# Altium project DAC-AK4493-DUAL.PrjPcb
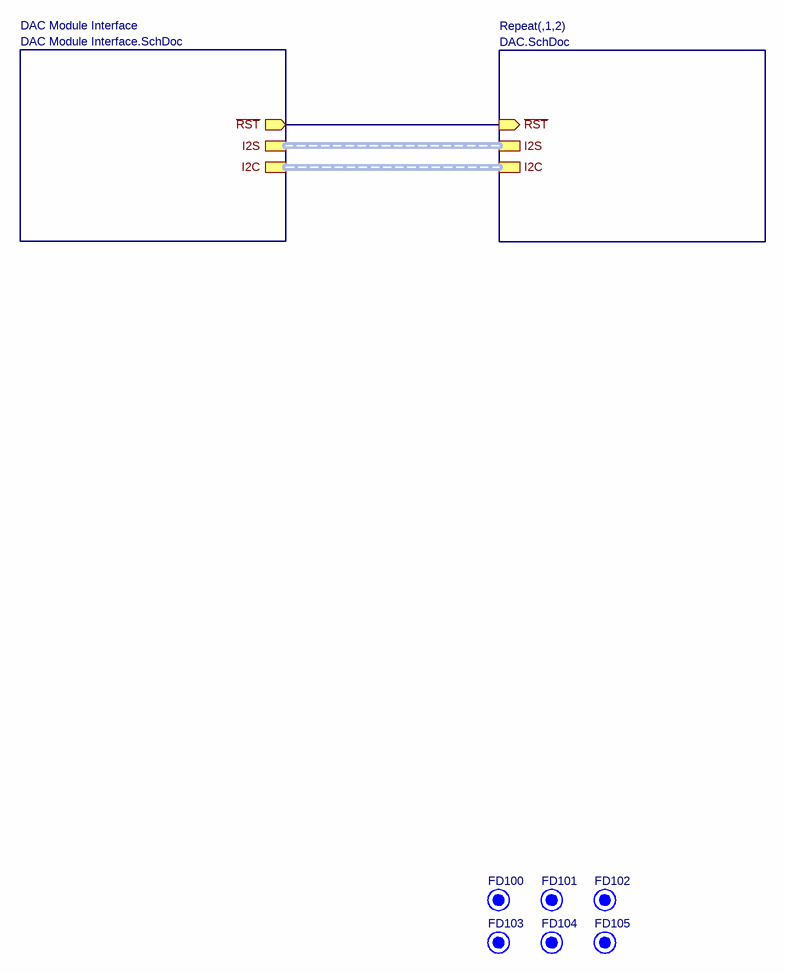
[diagram p0: Hardware Achitecture.SchDoc]
ProjectAuthors: Klossner, Lüthi; ProjectName: DAC-AK4493-DUAL; Revision: 1.1
3 sheets, 94 parts. Net scope: hierarchical (ports join the sheet entries above them; power ports are global).
Board file: DAC-AK4493-DUAL.PcbDoc
Sheets:
  Hardware Achitecture.SchDoc
    1 = DAC.SchDoc
    2 = DAC.SchDoc
    DAC Module Interface = DAC Module Interface.SchDoc

## Sheet Hardware Achitecture.SchDoc
size A3; Date: 27.05.2014; DrawnBy: luths8; Organization: BFH; Address1: Bern University of Applied Sciences; Address2: Engineering and Information Technology; Address3: Jlcoweg 1; Address4: CH-3400 Burgdorf; DocumentNumber: 1; Revision: 1.1; SheetNumber: 1; SheetTotal: 3; CurrentDate: 27.05.2014

### Parts
FD100  Fiducial  [FIDUCIAL]  (value not drawn)  (no BOM)
FD101  Fiducial  [FIDUCIAL]  (value not drawn)  (no BOM)
FD102  Fiducial  [FIDUCIAL]  (value not drawn)  (no BOM)
FD103  Fiducial  [FIDUCIAL]  (value not drawn)  (no BOM)
FD104  Fiducial  [FIDUCIAL]  (value not drawn)  (no BOM)
FD105  Fiducial  [FIDUCIAL]  (value not drawn)  (no BOM)

### Sub-sheets
DAC Module Interface = DAC Module Interface.SchDoc: ~{RST} (out), I2S (harness I2S), I2C (harness I2C)
Repeat(,1,2) = DAC.SchDoc: ~{RST} (in), I2S (harness I2S), I2C (harness I2C)

### Nets
~{DAC_RST}: sheet Repeat(,1,2)/~{RST}, sheet DAC Module Interface/~{RST}

### Buses and harness runs
harness sheet DAC Module Interface/I2C = sheet Repeat(,1,2)/I2C
harness sheet DAC Module Interface/I2S = sheet Repeat(,1,2)/I2S

### Notes on the sheet
- Project:
- Size:
- Sheet:
- Title:
- A3
- of
- Drawn by:
- Revision:
- Date:
- Variant:
- b
- File:

### Library data of the parts
FD100-FD105 = Fiducial: Fiducial Marker

## Sheet DAC.SchDoc
size A3; Date: 27.05.2014; DrawnBy: luths8; Organization: BFH; Address1: Bern University of Applied Sciences; Address2: Engineering and Information Technology; Address3: Jlcoweg 1; Address4: CH-3400 Burgdorf; DocumentNumber: 10; Revision: 1.1; SheetNumber: 3; SheetTotal: 3; CurrentDate: 27.05.2014
Used 2 times, as channels 1, 2. Parts and nets are listed once, with the designators drawn on the sheet.
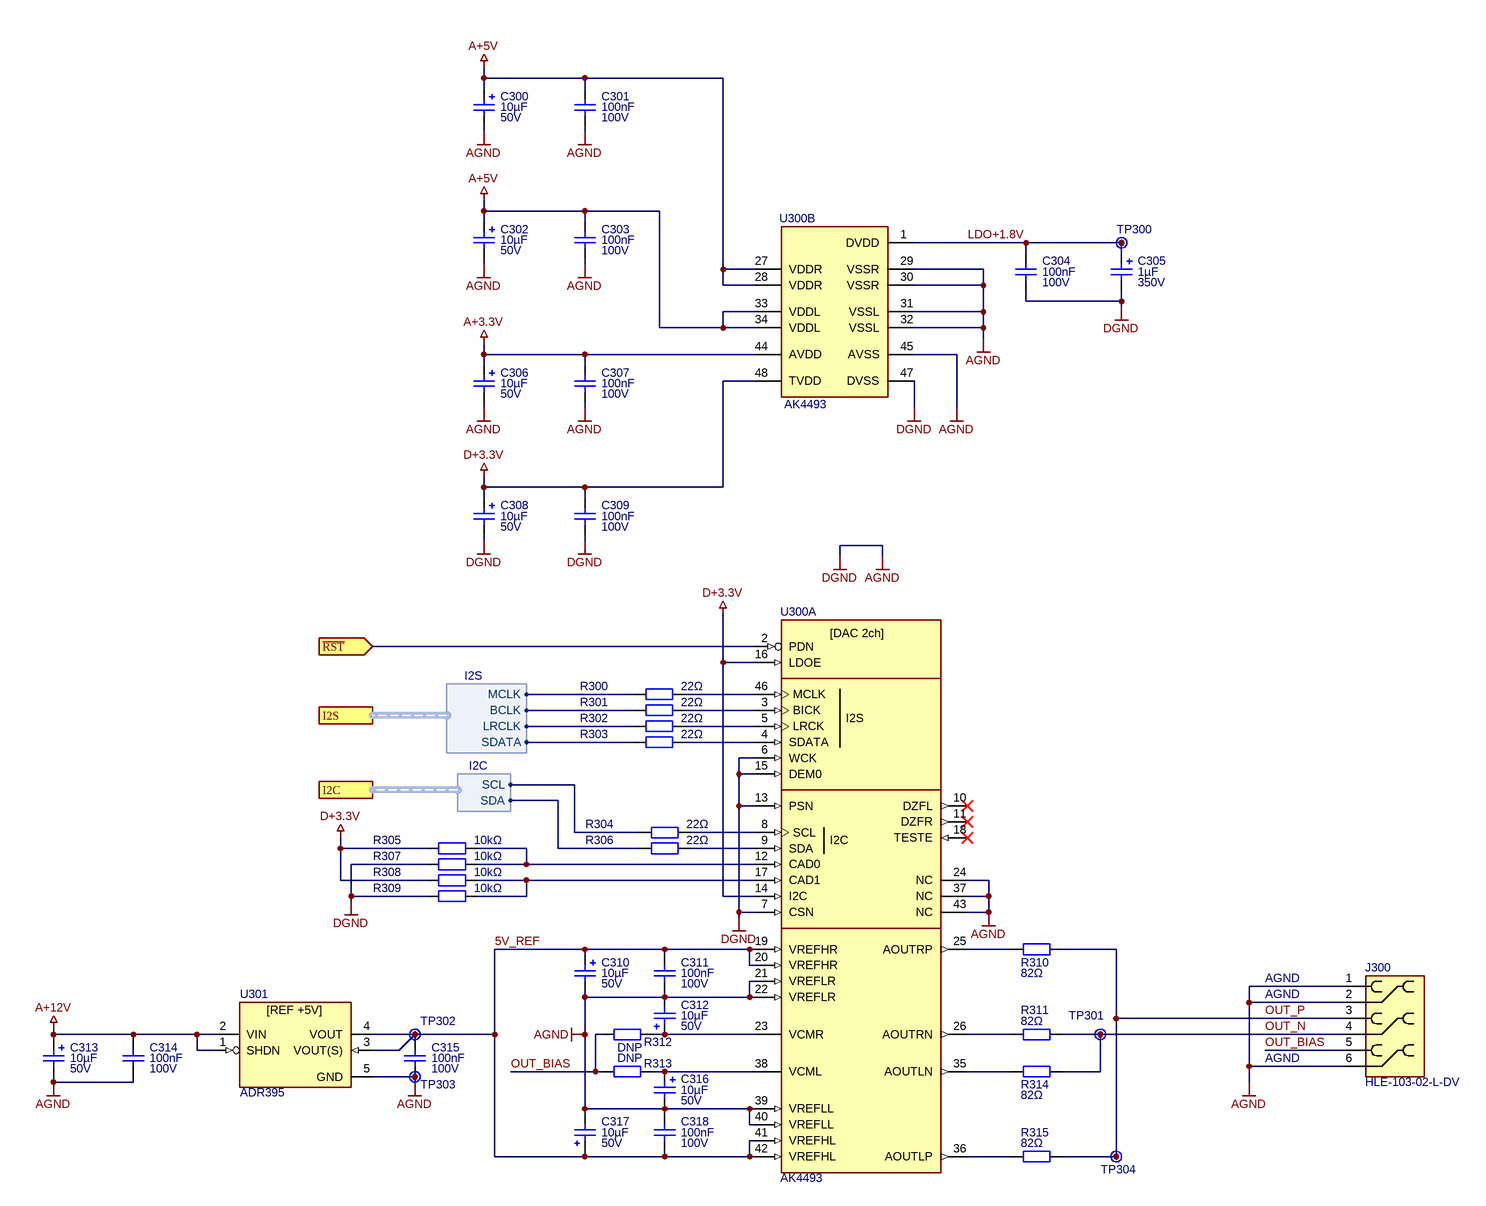
[diagram p1: DAC.SchDoc]

### Parts
C300  10µF  Voltage: 50V  [CAP-5-11.5-2]
C301  100nF  Voltage: 100V  [CAP_WIMA_MKP4F]
C302  10µF  Voltage: 50V  [CAP-5-11.5-2]
C303  100nF  Voltage: 100V  [CAP_WIMA_MKP4F]
C304  100nF  Voltage: 100V  [CAP_WIMA_MKP4F]
C305  1µF  Voltage: 350V  [CAP-6.3-11.2-2.5]
C306  10µF  Voltage: 50V  [CAP-5-11.5-2]
C307  100nF  Voltage: 100V  [CAP_WIMA_MKP4F]
C308  10µF  Voltage: 50V  [CAP-5-11.5-2]
C309  100nF  Voltage: 100V  [CAP_WIMA_MKP4F]
C310  10µF  Voltage: 50V  [CAP-5-11.5-2]
C311  100nF  Voltage: 100V  [CAP_WIMA_MKP4F]
C312  10µF  Voltage: 50V  [CAP-5-11.5-2]
C313  10µF  Voltage: 50V  [CAP-5-11.5-2]
C314  100nF  Voltage: 100V  [CAP_WIMA_MKP4F]
C315  100nF  Voltage: 100V  [CAP_WIMA_MKP4F]
C316  10µF  Voltage: 50V  [CAP-5-11.5-2]
C317  10µF  Voltage: 50V  [CAP-5-11.5-2]
C318  100nF  Voltage: 100V  [CAP_WIMA_MKP4F]
J300  HLE-103-02-L-DV  [HLE-103-02-XXX-DV]
R300  22Ω  [SMD0603RES]
R301  22Ω  [SMD0603RES]
R302  22Ω  [SMD0603RES]
R303  22Ω  [SMD0603RES]
R304  22Ω  [SMD0603RES]
R305  10kΩ  [SMD0603RES]
R306  22Ω  [SMD0603RES]
R307  10kΩ  [SMD0603RES]
R308  10kΩ  [SMD0603RES]
R309  10kΩ  [SMD0603RES]
R310  82Ω  [SMD0603RES]
R311  82Ω  [SMD0603RES]
R312  DNP  [SMD0603RES]
R313  DNP  [SMD0603RES]
R314  82Ω  [SMD0603RES]
R315  82Ω  [SMD0603RES]
TP300  Testpoint  [TP]  (value not drawn)  (no BOM)
TP301  Testpoint  [TP]  (value not drawn)  (no BOM)
TP302  Testpoint  [TP]  (value not drawn)  (no BOM)
TP303  Testpoint  [TP]  (value not drawn)  (no BOM)
TP304  Testpoint  [TP]  (value not drawn)  (no BOM)
U300  AK4493  [LQFP48]  (parts A,B of 2)
U301  ADR395  [SOT-23-5]

### Ports
I2C (harness I2C), I2S (harness I2S), ~{RST} (in)

### Harnesses
I2S: MCLK, BCLK, LRCLK, SDATA
I2C: SCL, SDA

### Nets
A+3.3V: C306.P C307.2(q) U300.44(AVDD)
A+5V: C300.P C301.2(q) C302.P C303.2(q) U300.27(VDDR) U300.28(VDDR) U300.33(VDDL) U300.34(VDDL)
A+12V: C313.P C314.2(q) U301.1(SHDN) U301.2(VIN)
AGND: C300.M(q) C301.1 C302.M(q) C303.1 C304.1 C305.M(q) C306.M(q) C307.1 C308.M(q) C309.1 C310.M(q) C311.1 C312.M(q) C313.M(q) C314.1 C315.1 C316.M(q) C317.M(q) C318.2(q) J300.1 J300.2 J300.6 R307.2 R309.2 TP303.1 U300.6(WCK) U300.7(CSN) U300.13(PSN) U300.15(DEM0) U300.21(VREFLR) U300.22(VREFLR) U300.24(NC) U300.29(VSSR) U300.30(VSSR) U300.31(VSSL) U300.32(VSSL) U300.37(NC) U300.39(VREFLL) U300.40(VREFLL) U300.43(NC) U300.45(AVSS) U300.47(DVSS) U301.5(GND)  [also labelled DGND]
D+3.3V: C308.P C309.2(q) R305.2 R308.2 U300.14(I2C) U300.16(LDOE) U300.48(TVDD)
5V_REF: C310.P C311.2(q) C315.2(q) C317.P C318.1 TP302.1 U300.19(VREFHR) U300.20(VREFHR) U300.41(VREFHL) U300.42(VREFHL) U301.3(VOUT(S)) U301.4(VOUT)
LDO+1.8V: C304.2(q) C305.P TP300.1 U300.1(DVDD)
OUT_BIAS: J300.5 R312.2 R313.2
OUT_N: J300.4 R311.1 R314.1 TP301.1
OUT_P: J300.3 R310.1 R315.1 TP304.1
~{RST}: U300.2(PDN) ; port ~{RST}
NetC312_P: C312.P R312.1 U300.23(VCMR)
NetC316_P: C316.P R313.1 U300.38(VCML)
NetR300_1: R300.1 U300.46(MCLK)
NetR300_2: R300.2 ; port I2S.MCLK
NetR301_1: R301.1 U300.3(BICK)
NetR301_2: R301.2 ; port I2S.BCLK
NetR302_1: R302.1 U300.5(LRCK)
NetR302_2: R302.2 ; port I2S.LRCLK
NetR303_1: R303.1 U300.4(SDATA)
NetR303_2: R303.2 ; port I2S.SDATA
NetR304_1: R304.1 U300.8(SCL)
NetR304_2: R304.2 ; port I2C.SCL
NetR305_1: R305.1 R307.1 U300.12(CAD0)
NetR306_1: R306.1 U300.9(SDA)
NetR306_2: R306.2 ; port I2C.SDA
NetR308_1: R308.1 R309.1 U300.17(CAD1)
NetR310_2: R310.2 U300.25(AOUTRP)
NetR311_2: R311.2 U300.26(AOUTRN)
NetR314_2: R314.2 U300.35(AOUTLN)
NetR315_2: R315.2 U300.36(AOUTLP)

Not connected (* = marked no-connect by the designer): U300 10(DZFL)* 11(DZFR)* 18(TESTE)*

### Channels
1: designators end in _A; ports ~{RST}=~{DAC_RST}
2: designators end in _B; ports ~{RST}=~{DAC_RST}

### Notes on the sheet
- AGND
- Project:
- Size:
- Sheet:
- Title:
- A3
- of
- Drawn by:
- Revision:
- Date:
- Variant:
- b
- File:
- (in symbol ADR395) [REF +5V]
- (in symbol AK4493, part A) [DAC 2ch]; I2S

### Library data of the parts
C300 C302 C306 C308 C310 C312 C313 C316 C317 = Capacitor Electrolytic: Elektrolytic Capacitor; Manufacturer Part No.: EEU-FR1H100
C301 C303 C304 C307 C309 C311 C314 C315 C318 = Capacitor Ceramic: Ceramic Capacitor; Manufacturer Part No.: MKP2D031001F00KF00
C305 = Capacitor Electrolytic: Elektrolytic Capacitor; Supplier 1: Mouser; Supplier Part Number 1: 667-ECA-2VM010; Manufacturer Part No.: *
J300 = Receptacle 3x2P: Manufacturer Part No.: HLE-103-02-L-DV
R300-R309 R312 R313 = Resistor: Manufacturer Part No.: *
R310 R311 R314 R315 = Resistor: Resistor Thin Film; Manufacturer Part No.: TNPW060322R0BEEA
U300 = AK4493: 32-Bit 2ch Audio DAC; Manufacturer Part No.: AK4493EQ
U301 = ADR395: Manufacturer Part No.: ADR395BUJZ-REEL7
TP300-TP304 = Testpoint: Manufacturer Part No.: *

## Sheet DAC Module Interface.SchDoc
size A3; Date: 27.05.2014; DrawnBy: Author; Organization: BFH; Address1: Bern University of Applied Sciences; Address2: Engineering and Information Technology; Address3: Jlcoweg 1; Address4: CH-3400 Burgdorf; DocumentNumber: 1; Revision: 1.1; SheetNumber: 2; SheetTotal: 3; CurrentDate: 27.05.2014
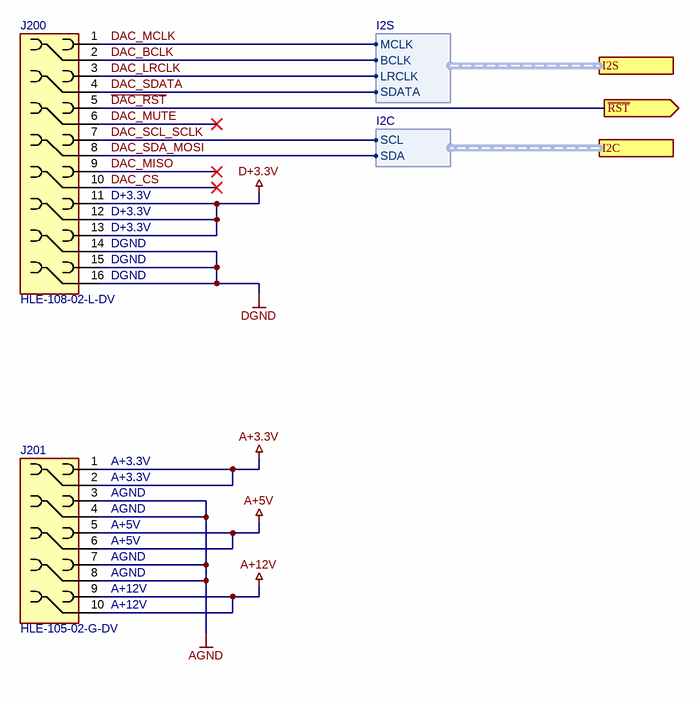
[diagram p2: DAC Module Interface.SchDoc]

### Parts
J200  HLE-108-02-L-DV  [HLE-108-02-XXX-DV-A]
J201  HLE-105-02-G-DV  [HLE-105-02-XXX-DV-A]

### Ports
I2C (harness I2C), I2S (harness I2S), ~{RST} (out)

### Harnesses
I2C: SCL, SDA
I2S: MCLK, BCLK, LRCLK, SDATA

### Nets
A+3.3V: J201.1 J201.2
A+5V: J201.5 J201.6
A+12V: J201.9 J201.10
AGND: J200.14 J200.15 J200.16 J201.3 J201.4 J201.7 J201.8  [also labelled DGND]
D+3.3V: J200.11 J200.12 J200.13
~{DAC_RST}: J200.5 ; port ~{RST}
DAC_BCLK: J200.2 ; port I2S.BCLK
DAC_CS: J200.10
DAC_LRCLK: J200.3 ; port I2S.LRCLK
DAC_MCLK: J200.1 ; port I2S.MCLK
DAC_MISO: J200.9
DAC_MUTE: J200.6
DAC_SCL_SCLK: J200.7 ; port I2C.SCL
DAC_SDA_MOSI: J200.8 ; port I2C.SDA
DAC_SDATA: J200.4 ; port I2S.SDATA

### Notes on the sheet
- (near J200) D+3.3V
- (near J200) DGND
- (near J201) A+3.3V
- (near J201) AGND
- (near J201) A+5V
- (near J201) A+12V
- Project:
- Size:
- Sheet:
- Title:
- A3
- of
- Drawn by:
- Revision:
- Date:
- Variant:
- b
- File:

### Library data of the parts
J200 = Receptacle 8x2P: Receptacle 5x2P; Manufacturer Part No.: HLE-108-02-L-DV
J201 = Receptacle 5x2P: Manufacturer Part No.: HLE-105-02-G-DV

## Nets that join several sheets
A+3.3V: 1 (C306_A.P C307_A.2 U300_A.44), 2 (C306_B.P C307_B.2 U300_B.44), DAC Module Interface (J201.1 J201.2)
A+5V: 1 (8 pins), 2 (8 pins), DAC Module Interface (J201.5 J201.6)
A+12V: 1 (C313_A.P C314_A.2 U301_A.1 U301_A.2), 2 (C313_B.P C314_B.2 U301_B.1 U301_B.2), DAC Module Interface (J201.9 J201.10)
AGND: 1 (43 pins), 2 (43 pins), DAC Module Interface (7 pins)
D+3.3V: 1 (7 pins), 2 (7 pins), DAC Module Interface (J200.11 J200.12 J200.13)
~{DAC_RST}: 1 (U300_A.2), 2 (U300_B.2), DAC Module Interface (J200.5)
DAC_BCLK: 1 (R301_A.2), 2 (R301_B.2), DAC Module Interface (J200.2)
DAC_LRCLK: 1 (R302_A.2), 2 (R302_B.2), DAC Module Interface (J200.3)
DAC_MCLK: 1 (R300_A.2), 2 (R300_B.2), DAC Module Interface (J200.1)
DAC_SCL_SCLK: 1 (R304_A.2), 2 (R304_B.2), DAC Module Interface (J200.7)
DAC_SDA_MOSI: 1 (R306_A.2), 2 (R306_B.2), DAC Module Interface (J200.8)
DAC_SDATA: 1 (R303_A.2), 2 (R303_B.2), DAC Module Interface (J200.4)